# EAGLE design DAC (EAGLE 7.6.0)
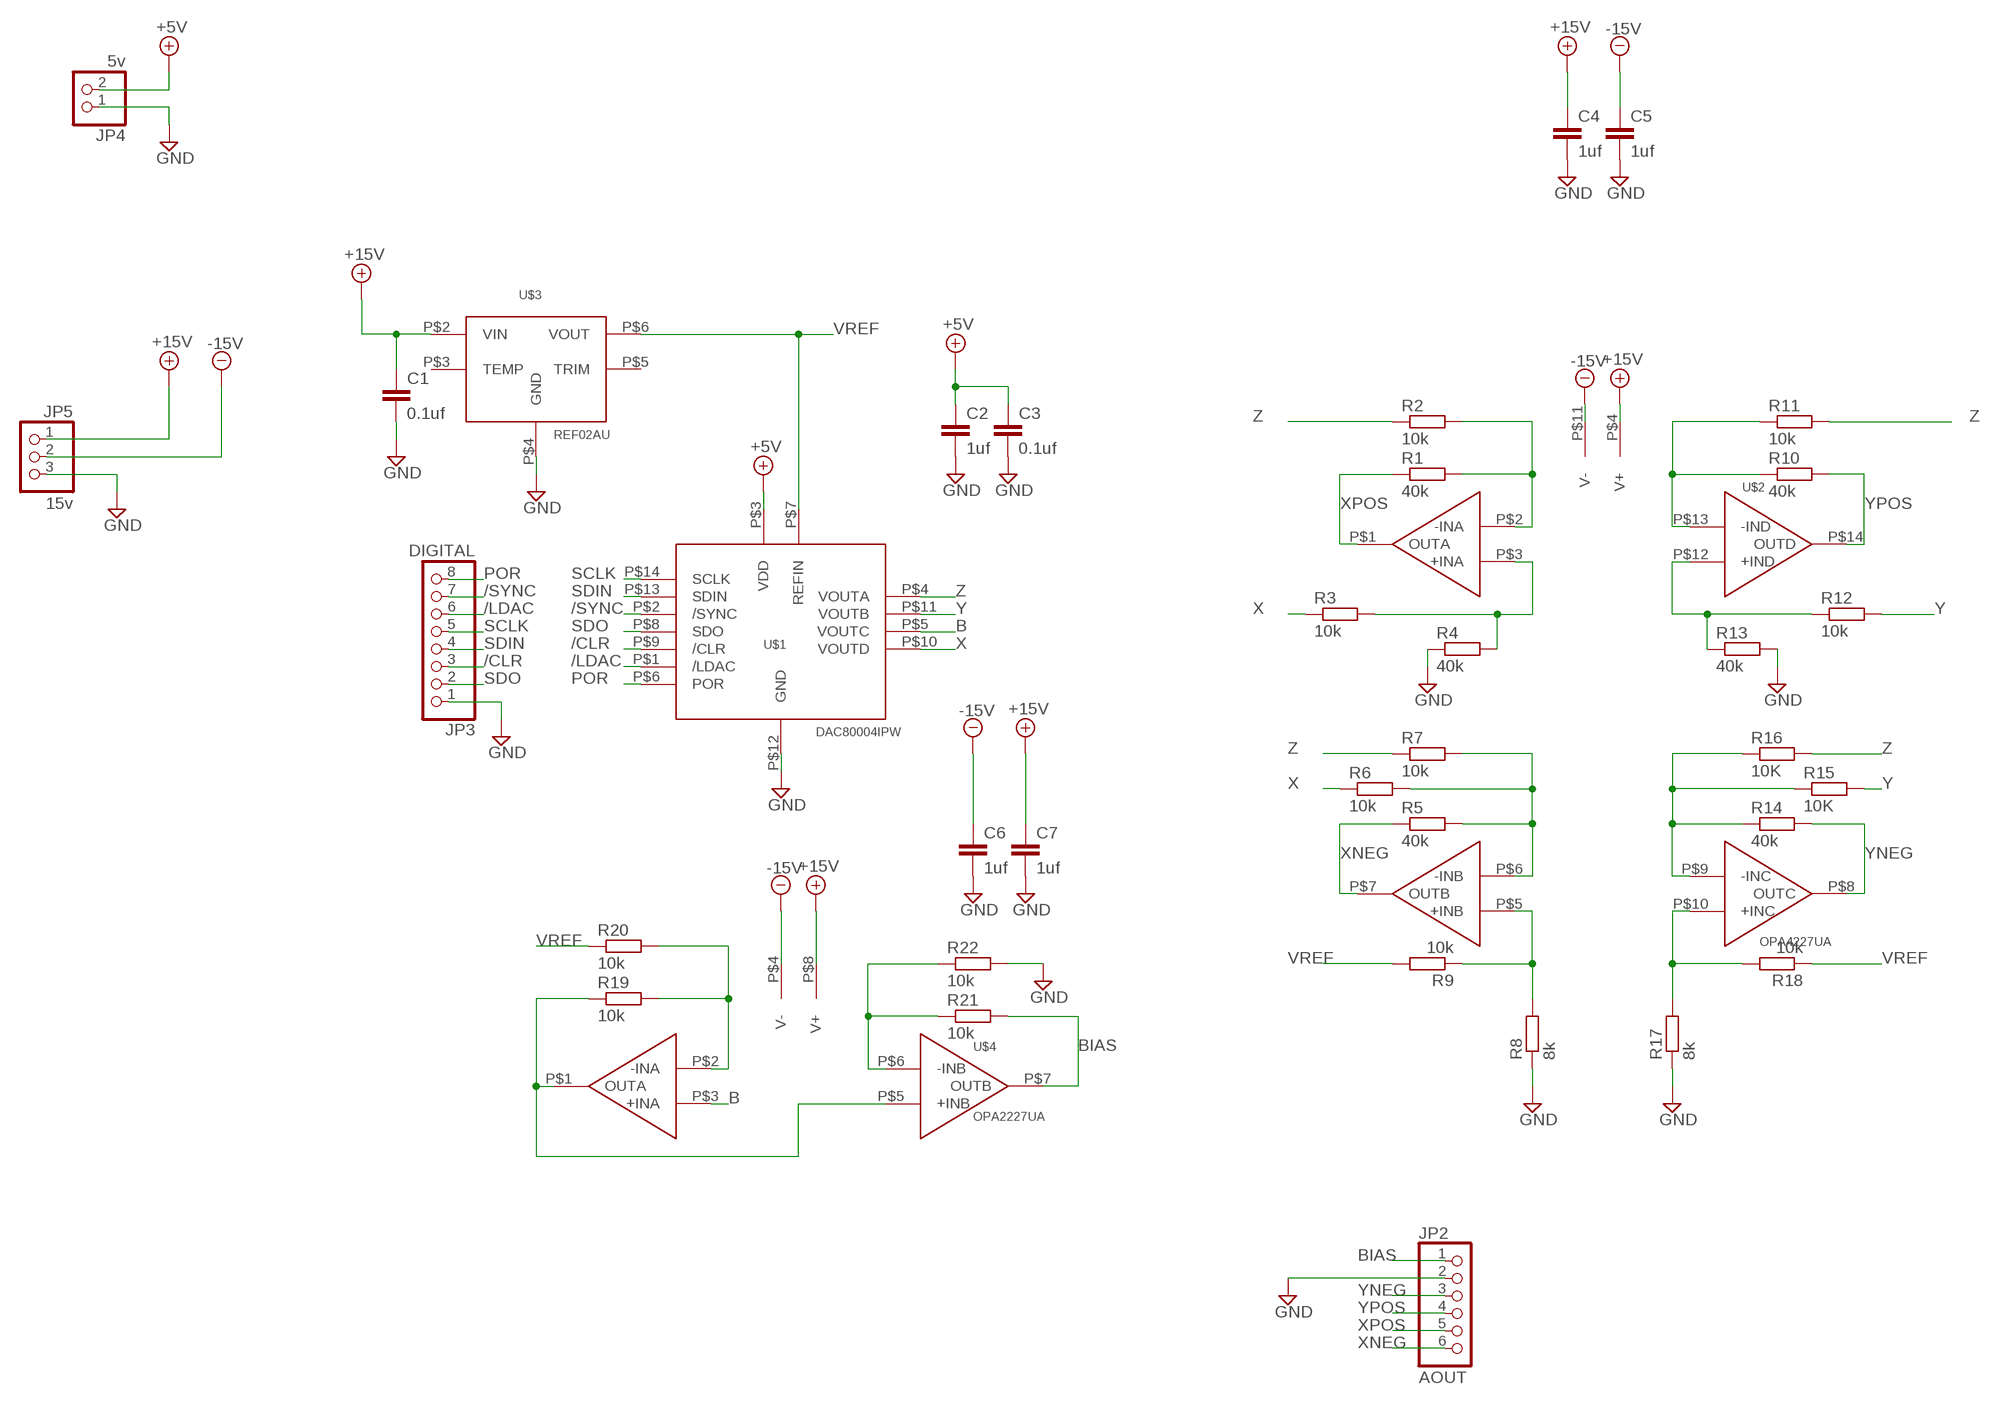
[diagram p0: schematic, sheet 1]

## Parts
C1  0.1uf  C-EUC0603  [C0603]
C2  1uf  C-EUC0603  [C0603]
C3  0.1uf  C-EUC0603  [C0603]
C4  1uf  C-EUC0603  [C0603]
C5  1uf  C-EUC0603  [C0603]
C6  1uf  C-EUC0603  [C0603]
C7  1uf  C-EUC0603  [C0603]
JP2  AOUT  PINHD-1X6  [1X06]
JP3  DIGITAL  PINHD-1X8  [1X08]
JP4  5v  PINHD-1X2  [1X02]
JP5  15v  PINHD-1X3  [1X03]
R1  40k  R-EU_R0603  [R0603]
R2  10k  R-EU_R0603  [R0603]
R3  10k  R-EU_R0603  [R0603]
R4  40k  R-EU_R0603  [R0603]
R5  40k  R-EU_R0603  [R0603]
R6  10k  R-EU_R0603  [R0603]
R7  10k  R-EU_R0603  [R0603]
R8  8k  R-EU_R0603  [R0603]
R9  10k  R-EU_R0603  [R0603]
R10  40k  R-EU_R0603  [R0603]
R11  10k  R-EU_R0603  [R0603]
R12  10k  R-EU_R0603  [R0603]
R13  40k  R-EU_R0603  [R0603]
R14  40k  R-EU_R0603  [R0603]
R15  10K  R-EU_R0603  [R0603]
R16  10K  R-EU_R0603  [R0603]
R17  8k  R-EU_R0603  [R0603]
R18  10k  R-EU_R0603  [R0603]
R19  10k  R-EU_R0603  [R0603]
R20  10k  R-EU_R0603  [R0603]
R21  10k  R-EU_R0603  [R0603]
R22  10k  R-EU_R0603  [R0603]
U$1  DAC80004IPW  [TSSOP14]
U$2  OPA4227UA  [SOIC-14]
U$3  REF02AU  [SO8]
U$4  OPA2227UA  [SOIC-8]

## Nets
+5V: C2.1 C3.1 JP4.2 U$1.P$3(VDD)
+15V: C1.1 C4.1 C7.1 JP5.1 U$2.P$4(V+) U$3.P$2(VIN) U$4.P$8(V+)
-15V: C5.1 C6.1 JP5.2 U$2.P$11(V-) U$4.P$4(V-)
/CLR: JP3.3 U$1.P$9(/CLR)
/LDAC: JP3.6 U$1.P$1(/LDAC)
/SYNC: JP3.7 U$1.P$2(/SYNC)
B: U$1.P$5(VOUTC) U$4.P$3(+INA)
BIAS: JP2.1 R21.2 U$4.P$7(OUTB)
GND: C1.2 C2.2 C3.2 C4.2 C5.2 C6.2 C7.2 JP2.2 JP3.1 JP4.1 JP5.3 R4.1 R8.1 R13.2 R17.1 R22.2 U$1.P$12(GND) U$3.P$4(GND)
N$4: R1.2 R2.2 U$2.P$2(-INA)
N$5: R3.2 R4.2 U$2.P$3(+INA)
N$6: R5.2 R6.2 R7.2 U$2.P$6(-INB)
N$7: R8.2 R9.1 U$2.P$5(+INB)
N$14: R12.1 R13.1 U$2.P$12(+IND)
N$15: R14.1 R15.1 R16.1 U$2.P$9(-INC)
N$16: R10.1 R11.1 U$2.P$13(-IND)
N$19: R19.2 R20.2 U$4.P$2(-INA)
N$20: R17.2 R18.2 U$2.P$10(+INC)
N$21: R19.1 U$4.P$1(OUTA) U$4.P$5(+INB)
N$22: R21.1 R22.1 U$4.P$6(-INB)
POR: JP3.8 U$1.P$6(POR)
SCLK: JP3.5 U$1.P$14(SCLK)
SDIN: JP3.4 U$1.P$13(SDIN)
SDO: JP3.2 U$1.P$8(SDO)
VREF: R9.2 R18.1 R20.1 U$1.P$7(REFIN) U$3.P$6(VOUT)
X: R3.1 R6.1 U$1.P$10(VOUTD)
XNEG: JP2.6 R5.1 U$2.P$7(OUTB)
XPOS: JP2.5 R1.1 U$2.P$1(OUTA)
Y: R12.2 R15.2 U$1.P$11(VOUTB)
YNEG: JP2.3 R14.2 U$2.P$8(OUTC)
YPOS: JP2.4 R10.2 U$2.P$14(OUTD)
Z: R2.1 R7.1 R11.2 R16.2 U$1.P$4(VOUTA)
Unconnected: U$3.P$3(TEMP) U$3.P$5(TRIM)

## Library data of the parts
C1-C7 = resistor:C-EU: CAPACITOR, European symbol
JP2 = pinhead:PINHD-1X6: PIN HEADER
JP3 = pinhead:PINHD-1X8: PIN HEADER
JP4 = pinhead:PINHD-1X2: PIN HEADER
JP5 = pinhead:PINHD-1X3: PIN HEADER
R1-R22 = resistor:R-EU_: RESISTOR, European symbol
U$1 = DAC80004:DAC80004IPW
U$2 = OPAX22X:OPA4227UA
U$3 = REF02:REF02AU
U$4 = OPAX22X:OPA2227UA

## Board
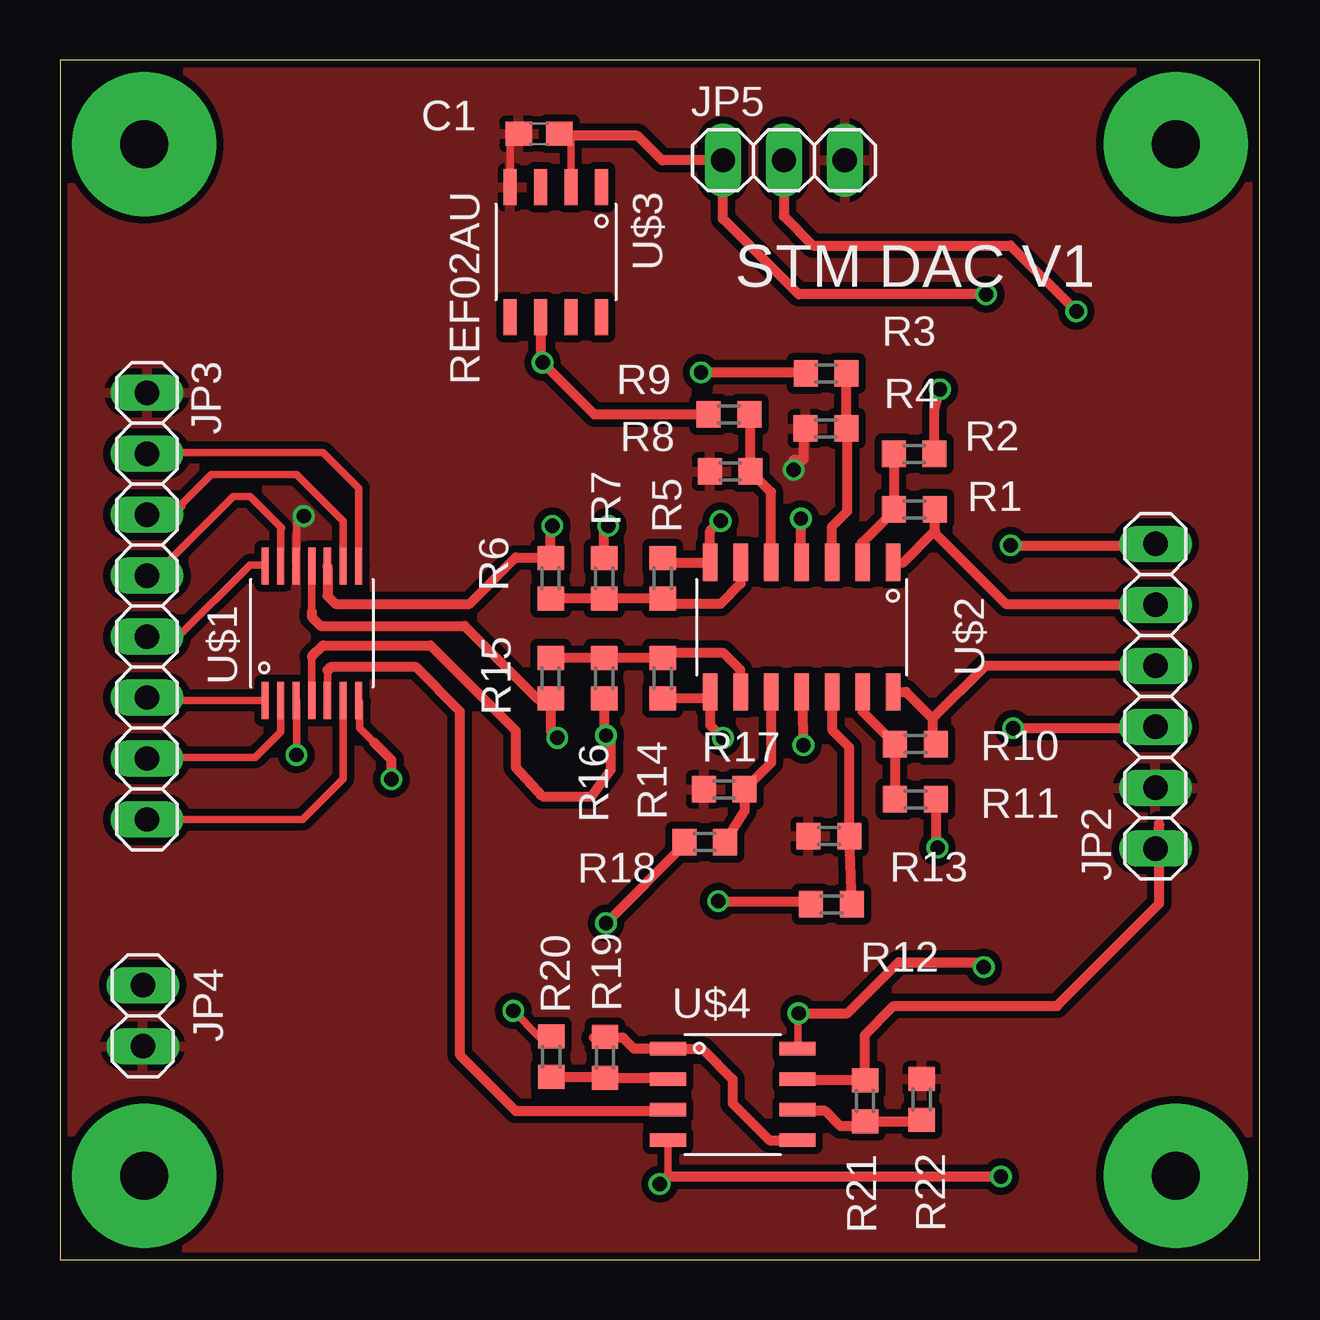
[diagram p1: board, top side]
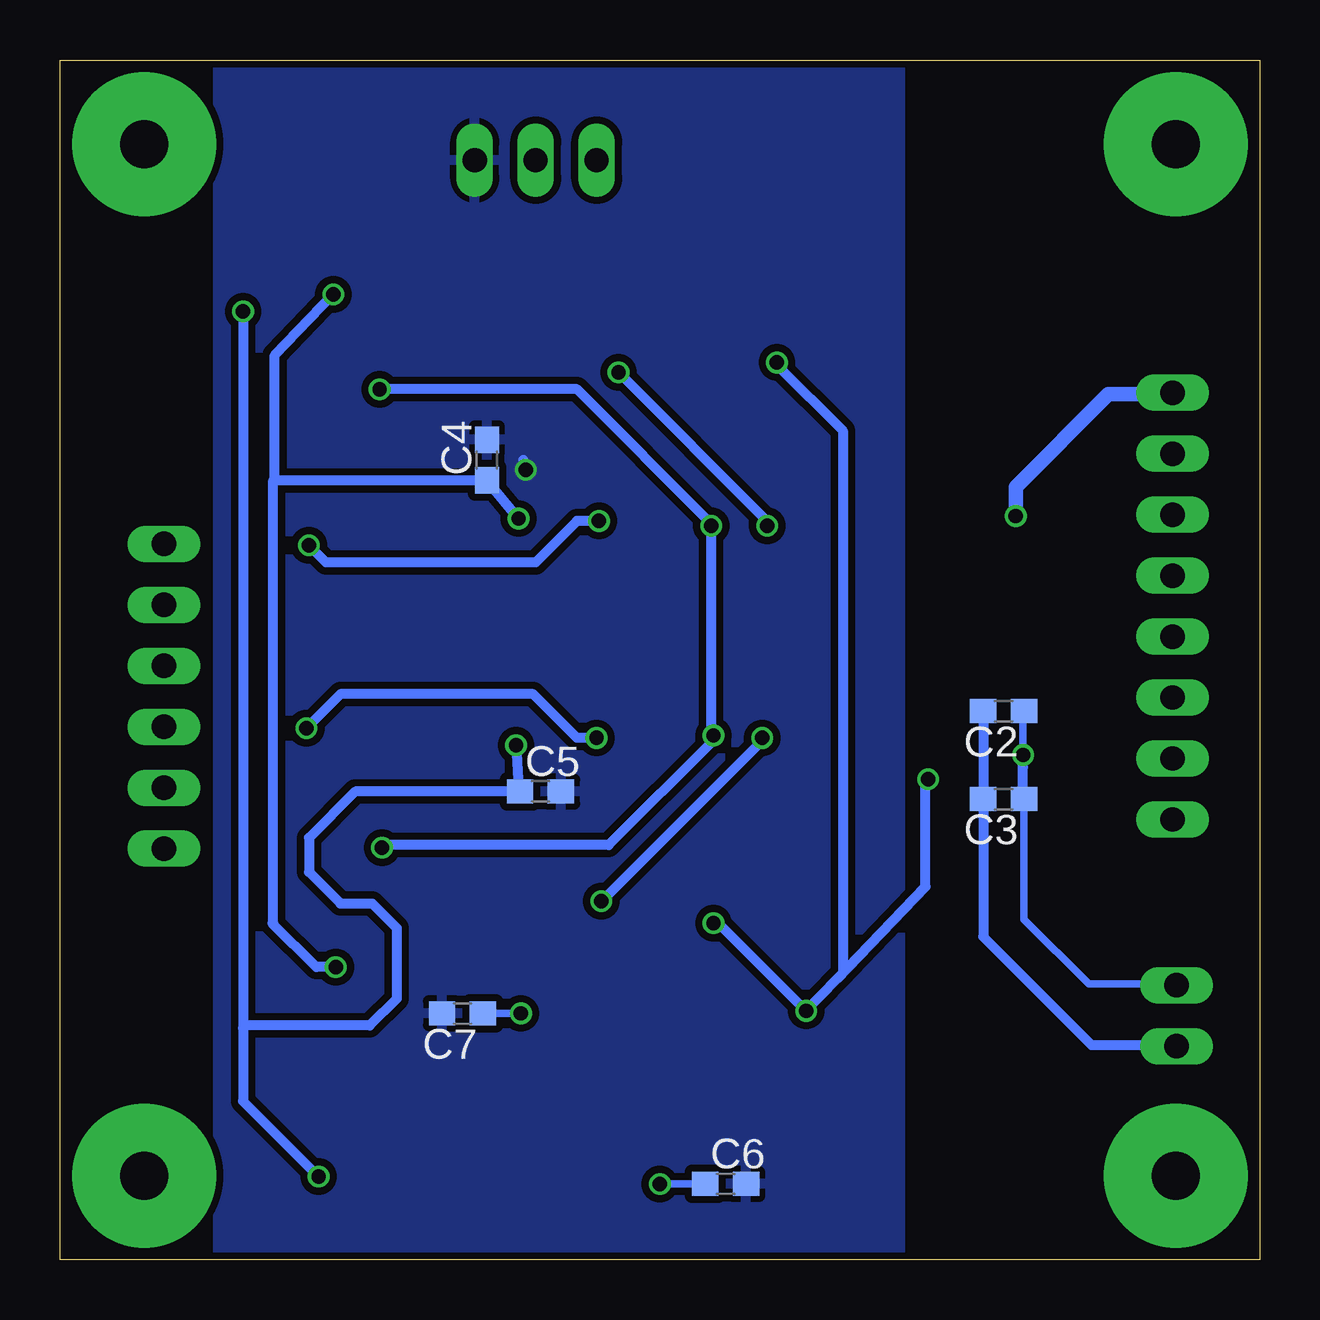
[diagram p2: board, bottom side, seen from below]

Size 50 x 50 mm. Coordinates in mm from the lower left corner, seen from the top.
Outline: 0,0 50,0 50,50 0,50 0,0
Copper layers (1*16): Top 0.035mm / dielectric 1.5mm / Bottom 0.035mm
Design rules "dirt_cheap_dirty_boards.v1": minimum track width 5mil, minimum drill 12mil, track to track 5mil, track to pad 5mil, pad to pad 5mil, via to via 5mil, smd to smd 0mil, copper to edge 10mil, drill to drill 10mil, minimum pad ring 10mil, minimum via ring 6mil, stop-mask expansion 2mil, vias tented up to drill 25mil, thermal gap 10mil

### Footprints (pad centres in the part's own frame; a part is rotated, then mirrored left to right if it is on the bottom)
C0603 = smd 1.1 x 1: 1 -0.85,0; 2 0.85,0
1X06 = drill 1.016 long: 1 -6.35,0; 2 -3.81,0; 3 -1.27,0; 4 1.27,0; 5 3.81,0; 6 6.35,0
1X08 = drill 1.016 long: 1 -8.89,0; 2 -6.35,0; 3 -3.81,0; 4 -1.27,0; 5 1.27,0; 6 3.81,0; 7 6.35,0; 8 8.89,0
1X02 = drill 1.016 long: 1 -1.27,0; 2 1.27,0
1X03 = drill 1.016 long: 1 -2.54,0; 2 0,0; 3 2.54,0
R0603 = smd 1 x 1.1: 1 -0.85,0; 2 0.85,0
TSSOP14 = smd 1.55 x 0.3: P$1 -2.8,1.95; P$2 -2.8,1.3; P$3 -2.8,0.65; P$4 -2.8,0; P$5 -2.8,-0.65; P$6 -2.8,-1.3; P$7 -2.8,-1.95; P$8 2.8,-1.95; P$9 2.8,-1.3; P$10 2.8,-0.65; P$11 2.8,0; P$12 2.8,0.65; P$13 2.8,1.3; P$14 2.8,1.95
SOIC-14 = smd 1.55 x 0.6: P$1 -2.7,3.81; P$2 -2.7,2.54; P$3 -2.7,1.27; P$4 -2.7,0; P$5 -2.7,-1.27; P$6 -2.7,-2.54; P$7 -2.7,-3.81; P$8 2.7,-3.81; P$9 2.7,-2.54; P$10 2.7,-1.27; P$11 2.7,0; P$12 2.7,1.27; P$13 2.7,2.54; P$14 2.7,3.81
SO8 = smd 1.5 x 0.55: P$1 -2.7,2.54; P$2 -2.7,1.27; P$3 -2.7,0; P$4 -2.7,-1.27; P$5 2.7,-1.27; P$6 2.7,0; P$7 2.7,1.27; P$8 2.7,2.54
SOIC-8 = smd 1.5 x 0.55: P$1 -2.7,1.27; P$2 -2.7,0; P$3 -2.7,-1.27; P$4 -2.7,-2.54; P$5 2.7,-2.54; P$6 2.7,-1.27; P$7 2.7,0; P$8 2.7,1.27

### Placement (x,y rotation side)
C1  19.97,46.92 180 top
C2  10.67,22.86 180 bottom
C3  10.67,19.2 180 bottom
C4  32.21,33.32 90 bottom
C5  29.97,19.51 0 bottom
C6  22.25,3.15 0 bottom
C7  33.22,10.26 180 bottom
JP2  45.66,23.48 90 top
JP3  3.63,27.24 270 top
JP4  3.45,10.16 90 top
JP5  30.18,45.82 0 top
R1  35.61,31.26 180 top
R2  35.61,33.58 180 top
R3  31.94,36.93 0 top
R4  31.93,34.64 0 top
R5  25.12,28.4 270 top
R6  20.45,28.4 270 top
R7  22.69,28.4 270 top
R8  27.94,32.85 0 top
R9  27.89,35.23 180 top
R10  35.65,21.49 0 top
R11  35.65,19.18 0 top
R12  32.16,14.8 180 top
R13  32.05,17.65 180 top
R14  25.12,24.23 270 top
R15  20.45,24.23 270 top
R16  22.69,24.23 270 top
R17  27.69,19.6 0 top
R18  26.87,17.4 0 top
R19  22.72,8.43 270 top
R20  20.48,8.46 270 top
R21  33.56,6.61 90 top
R22  35.92,6.68 90 top
U$1  10.5,26.11 90 top
U$2  30.91,26.36 270 top
U$3  20.04,41.99 270 top
U$4  28.04,7.52 0 top

### Tracks (layer width: path | path; a pad name or v marks a point on that pad's centre or on a via)
+5V  (via drill 0.6)
  Top 0.305: U$1.P$3 v9.86,21.03
  Bottom 0.305: C3.1 9.82,14.19 7.11,11.48 3.5,11.48 JP4.2 | C2.1 9.86,22.86 9.86,20.52
  Bottom 0.406: 9.82,21.07 v9.86,21.03 9.86,20.52 9.86,19.24 9.82,19.24 C3.1
+15V  (via drill 0.6)
  Top 0.305: U$3.P$2 21.31,46.84 C1.1 | U$4.P$8 30.74,8.69 v30.79,10.26
  Top 0.406: 21.31,46.84 24.08,46.84 25.09,45.82 JP5.1 27.64,43.38 30.79,40.23 v38.61,40.23 | U$2.P$4 30.89,29.06 v30.89,30.89 | v30.79,10.26 32.82,10.26 34.95,12.39 38.3,12.39 v38.51,12.19
  Bottom 0.305: v30.79,10.26 C7.1
  Bottom 0.406: v30.89,30.89 C4.1 41.05,32.48 | v38.51,12.19 39.32,12.19 41.15,14.02 41.11,14.02 41.11,32.48 41.05,32.48 | v38.61,40.23 41.05,37.69 41.05,32.48
-15V  (via drill 0.6)
  Top 0.305: U$4.P$4 25.34,3.5 v24.99,3.15
  Top 0.406: U$2.P$11 30.91,23.7 v30.99,21.44 | JP5.2 30.18,43.48 31.39,42.27 39.62,42.27 v42.37,39.52 | v39.22,3.45 25.3,3.45 v24.99,3.15
  Bottom 0.305: v24.99,3.15 C6.1
  Bottom 0.406: v30.99,21.44 30.89,19.65 C5.1 37.69,19.51 39.62,17.58 39.62,16.15 38.3,14.83 36.98,14.83 35.97,13.82 35.97,10.87 37.08,9.75 42.27,9.75 42.37,9.65 | v42.37,39.52 42.37,9.65 | 42.37,9.65 42.37,6.6 v39.22,3.45
/CLR
  Top 0.305: U$1.P$9 11.8,30.77 9.86,32.72 6.3,32.72 5.08,31.5 5.08,31.39 4.78,31.09 3.67,31.09 JP3.3
/LDAC
  Top 0.305: U$1.P$1 3.75,23.31 JP3.6
/SYNC
  Top 0.305: U$1.P$2 9.2,22 8.13,20.93 3.67,20.93 JP3.7
B
  Top 0.305: U$1.P$5 11.15,24.56
  Top 0.406: 11.15,24.56 11.28,24.69 14.83,24.69 16.66,22.86 16.66,8.53 19,6.2 25.29,6.2 U$4.P$3
BIAS
  Top 0.406: U$4.P$7 30.8,7.46 R21.2 33.55,9.37 34.75,10.57 41.55,10.57 45.82,14.83 45.82,18.19 JP2.1
GND  (via drill 0.6)
  Top 0.305: U$3.P$4 18.77,46.98 C1.2 | U$1.P$12 9.86,30.23 9.86,30.68 v10.16,30.99
  Top 0.406: R4.1 30.99,34.64 30.99,33.33 30.58,33.33 v30.58,32.92
  Bottom 0.305: 3.68,36.07 JP3.1
  Bottom 0.406: C2.2 C3.2 11.52,13.45 7.01,8.94 3.5,8.94 JP4.1 | v30.58,32.92 30.58,33.02 30.68,33.02 30.68,33.33
  Bottom 0.61: v10.16,30.99 10.16,32.21 6.3,36.07 3.68,36.07
  pour Top (isolate 0.305): 0,50 50,50 50,0 0,0
  pour Bottom (isolate 0.305): 15,0 43.4,0 43.4,50 15,50
N$1  (via drill 2 pad 6)
  other vias: 3.5,46.5
N$2  (via drill 2 pad 6)
  other vias: 46.5,46.5
N$3  (via drill 2 pad 6)
  other vias: 46.5,3.5
N$4
  Top 0.406: U$2.P$2 33.43,29.09 33.43,29.87 34.76,31.2 R1.2 R2.2
N$5
  Top 0.406: U$2.P$3 32.18,30.56 32.82,31.19 32.82,34.6 R4.2 32.78,36.92 R3.2
N$6
  Top 0.406: U$2.P$6 28.37,28.17 27.53,27.33 25.14,27.33 R5.2 R7.2 R6.2
N$7
  Top 0.406: U$2.P$5 29.64,31.99 R8.2 28.79,35.17 R9.1
N$8  (via drill 2 pad 6)
  other vias: 3.5,3.5
N$14
  Top 0.406: U$2.P$12 32.21,23.64 32.21,22.05 32.91,21.35 R13.1 R12.1
N$15
  Top 0.406: U$2.P$9 28.35,23.69 28.35,24.59 27.64,25.3 25.4,25.3 25.18,25.08 R14.1 R16.1 R15.1
N$16
  Top 0.406: U$2.P$13 33.45,22.84 R10.1 R11.1
N$19
  Top 0.406: R20.2 22.18,7.61 R19.2 25.28,7.58 U$4.P$2
N$20
  Top 0.406: U$2.P$10 29.64,20.7 R17.2 28.54,18.7 R18.2
N$21
  Top 0.406: R19.1 22.24,9.25 23.47,9.25 23.93,8.79 U$4.P$1 26.77,8.79 28.04,7.52 28.04,6.5 29.57,4.98 U$4.P$5
N$22
  Top 0.406: R22.1 35.65,5.76 R21.1 33.35,5.56 32.54,5.56 31.9,6.2 30.79,6.2 U$4.P$6
POR
  Top 0.305: JP3.8 10.12,18.34 11.8,20.03 U$1.P$6
SCLK
  Top 0.305: JP3.5 4.93,25.96 7.92,28.96 8.5,28.96 U$1.P$14
SDIN
  Top 0.305: JP3.4 3.7,28.5 3.76,28.45 3.86,28.45 7.21,31.8 7.92,31.8 9.25,30.48 9.2,30.43 U$1.P$13
SDO
  Top 0.305: U$1.P$8 12.45,32.15 10.97,33.63 3.67,33.63 JP3.2
VREF  (via drill 0.6)
  Top 0.305: 13.11,21.54 12.5,22.15 12.5,23.26 U$1.P$7 | R20.1 19.95,9.31 v18.9,10.36
  Top 0.406: v13.82,20.02 13.82,20.83 13.11,21.54 | U$3.P$6 20.04,37.47 v20.12,37.39 22.28,35.23 R9.2 | R18.1 26.04,17.3 v22.76,14.02
  Bottom 0.305: 13.92,19.91 v13.82,20.02
  Bottom 0.406: 17.61,11.7 v18.9,10.36 22.55,14.02 v22.76,14.02 | 17.61,11.7 13.92,15.54 13.92,19.91 | v20.12,37.39 20.12,37.29 17.37,34.54 17.37,11.94 17.61,11.7
X  (via drill 0.6)
  Top 0.406: U$1.P$10 11.15,27.66 11.48,27.33 17.07,27.33 19,29.26 20.44,29.26 R6.1 20.45,30.51 v20.52,30.58 | v26.72,36.98 31.04,36.98 R3.1
  Bottom 0.406: v20.52,30.58 20.52,30.79 v26.72,36.98
XNEG  (via drill 0.6)
  Top 0.406: 27.09,29.04 U$2.P$7 | R5.1 25.12,29.06 U$2.P$7 | U$2.P$7 27.1,30.36 v27.53,30.79 | v39.62,29.77 45.61,29.77 JP2.6
  Bottom 0.406: v27.53,30.79 28.45,30.79 30.18,29.06 38.91,29.06 v39.62,29.77
XPOS
  Top 0.406: U$2.P$1 35.16,29.06 36.47,30.38 | 36.47,30.38 36.47,31.25 R1.1 | 36.47,30.38 36.47,30.28 39.42,27.33 45.62,27.33 JP2.5
Y  (via drill 0.6)
  Top 0.305: U$1.P$11 10.5,26.99
  Top 0.406: 10.5,26.99 10.5,26.79 10.87,26.42 16.87,26.42 19.91,23.37 20.44,23.37 R15.2 20.45,22.02 v20.73,21.74 | v27.43,14.94 31.28,14.94 R12.2
  Bottom 0.406: v20.73,21.74 20.73,21.64 v27.43,14.94
YNEG  (via drill 0.6)
  Top 0.406: U$2.P$8 27.1,23.38 | 27.1,23.38 R14.2 | 27.1,23.38 27.1,22.27 v27.64,21.74 | v39.73,22.15 45.61,22.15 JP2.3
  Bottom 0.406: v27.64,21.74 28.45,21.74 30.28,23.57 38.3,23.57 v39.73,22.15
YPOS
  Top 0.406: U$2.P$14 35.27,23.66 36.37,22.55 | 36.37,22.55 36.37,21.41 R10.2 | JP2.4 38.56,24.75 36.37,22.55
Z  (via drill 0.6)
  Top 0.305: U$1.P$4 10.5,25.13
  Top 0.406: 10.5,25.13 10.97,25.6 15.44,25.6 19,22.05 19,20.52 20.12,19.3 22.15,19.3 22.96,20.42 22.96,21.64 v22.76,21.84 22.69,21.92 R16.2 | R2.1 36.46,35.48 v36.68,36.27 | R11.2 36.5,17.24 v36.58,17.17 | R7.1 22.69,30.41 v22.86,30.58
  Bottom 0.406: v36.58,17.17 36.47,17.27 27.13,17.27 22.76,21.64 v22.76,21.84 22.86,21.95 v22.86,30.58 22.86,30.68 28.45,36.27 v36.68,36.27

### Text on the board
tPlace: STM DAC V1